# EAGLE design pcb (EAGLE 9.3.1)

## Sheet 1 of 3
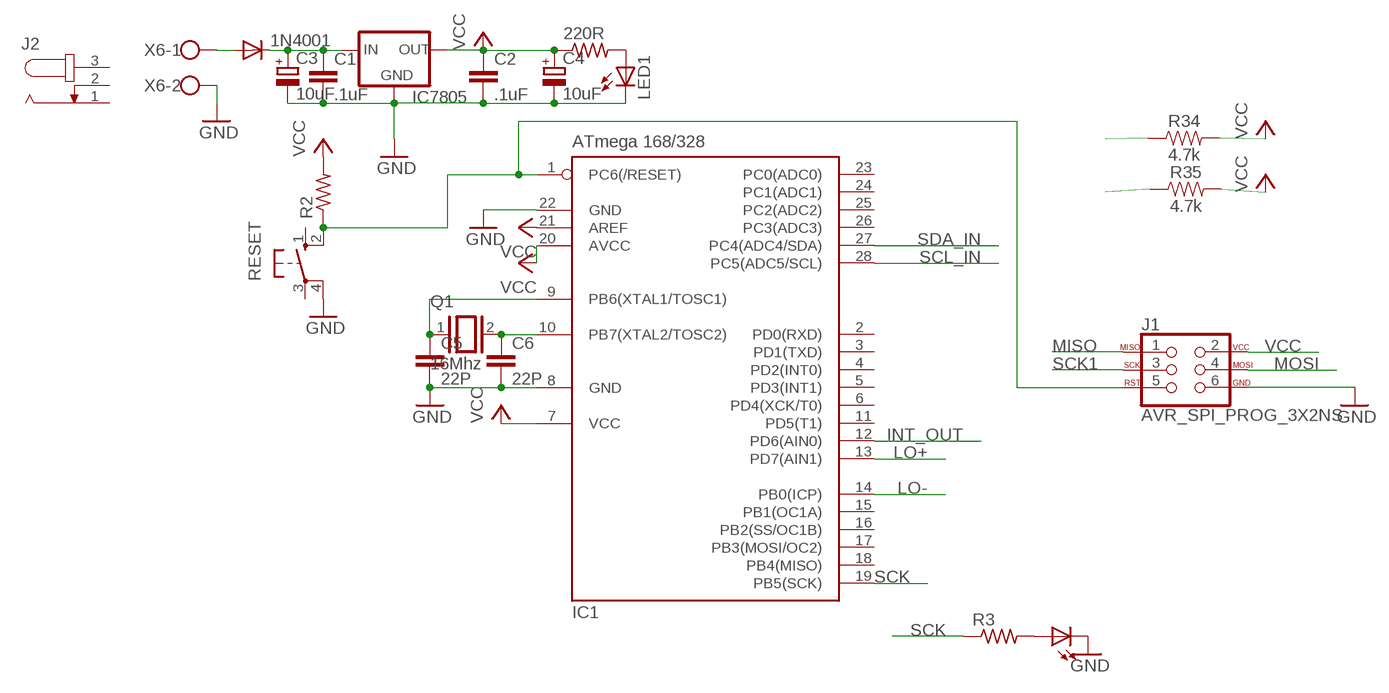
[diagram p0: schematic, sheet 1]

### Parts
1N4001  BYT85  [DO220S]
220R  R-US_0204/7  [0204/7]
C1  .1uF  C-EU025-024X044  [C025-024X044]
C2  .1uF  C-EU025-024X044  [C025-024X044]
C3  10uF  CPOL-EUE1.8-4  [E1,8-4]
C4  10uF  CPOL-EUE1.8-4  [E1,8-4]
C5  22P  C-EU025-024X044  [C025-024X044]
C6  22P  C-EU025-024X044  [C025-024X044]
IC1  ATmega 168/328  MEGA8-P  [DIL28-3]
IC7805  78XXS  [78XXS]
J1  AVR_SPI_PROG_3X2NS  [2X3-NS]
J2  JACK-PLUG0  [SPC4077]
LED1  LED3MM  [LED3MM]
LED2  LED3MM  [LED3MM]
Q1  16Mhz  XTAL/S  [QS]
R2  R-US_0204/7  [0204/7]
R3  R-US_0204/7  [0204/7]
R34  4.7k  4.7KOHM-0603-1/10W-1%  [0603]
R35  4.7k  4.7KOHM-0603-1/10W-1%  [0603]
RESET  10-XX  [B3F-10XX]
X6  W237-102  [W237-102]

### Nets
GND: C1.2 C2.2 C3.- C4.- C5.2 C6.2 IC1.8(GND) IC1.22(GND) IC7805.GND J1.6 LED1.K(C) LED2.K(C) RESET.4(P1) X6.2 ; also sheet 2,3
INT_OUT: IC1.12(PD6(AIN0)) ; also sheet 3
LO+: IC1.13(PD7(AIN1)) ; also sheet 2
LO-: IC1.14(PB0(ICP)) ; also sheet 2
MISO: J1.1
MOSI: J1.4
N$1: 1N4001.C C1.1 C3.+ IC7805.IN
N$2: R34.1
N$3: R35.1
N$21: 1N4001.A X6.1
N$23: 220R.2 LED1.A
N$24: C6.1 IC1.10(PB7(XTAL2/TOSC2)) Q1.2
N$25: C5.1 IC1.9(PB6(XTAL1/TOSC1)) Q1.1
N$26: IC1.1(PC6(/RESET)) J1.5 R2.1 RESET.2(S1)
N$30: LED2.A R3.2
SCK: IC1.19(PB5(SCK)) R3.1
SCK1: J1.3
SCL_IN: IC1.28(PC5(ADC5/SCL)) ; also sheet 3
SDA_IN: IC1.27(PC4(ADC4/SDA)) ; also sheet 3
VCC: 220R.1 C2.1 C4.+ IC1.7(VCC) IC1.20(AVCC) IC1.21(AREF) IC7805.OUT J1.2 R2.2 R34.2 R35.2 ; also sheet 3
Unconnected: IC1.2(PD0(RXD)) IC1.3(PD1(TXD)) IC1.4(PD2(INT0)) IC1.5(PD3(INT1)) IC1.6(PD4(XCK/T0)) IC1.11(PD5(T1)) IC1.15(PB1(OC1A)) IC1.16(PB2(SS/OC1B)) IC1.17(PB3(MOSI/OC2)) IC1.18(PB4(MISO)) IC1.23(PC0(ADC0)) IC1.24(PC1(ADC1)) IC1.25(PC2(ADC2)) IC1.26(PC3(ADC3)) J2.1 J2.2 J2.3 RESET.1(S) RESET.3(P)

## Sheet 2 of 3
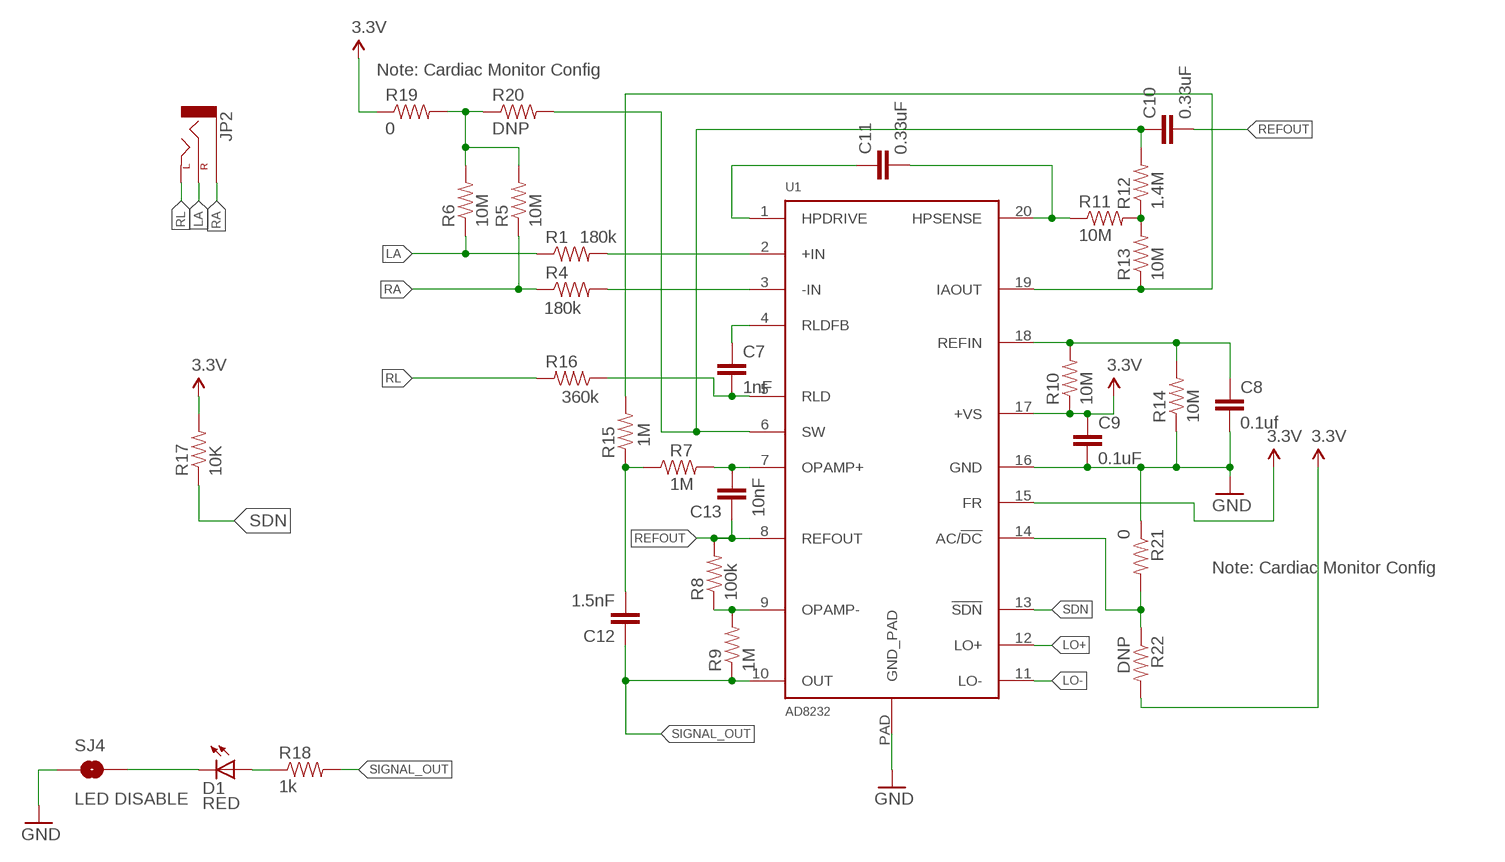
[diagram p1: schematic, sheet 2]

### Parts
C7  1nF  CAP0603-CAP  [0603-CAP]
C8  0.1uf  CAP0603-CAP  [0603-CAP]
C9  0.1uF  CAP0603-CAP  [0603-CAP]
C10  0.33uF  CAP0805  [0805]
C11  0.33uF  CAP0805  [0805]
C12  1.5nF  CAP0603-CAP  [0603-CAP]
C13  10nF  CAP0603-CAP  [0603-CAP]
D1  RED  LED-RED0603  [LED-0603]
JP2  AUDIO-JACKSMD2  [AUDIO-JACK-3.5MM-SMD]
R1  180k  RESISTOR0603-RES  [0603-RES]
R4  180k  RESISTOR0603-RES  [0603-RES]
R5  10M  RESISTOR0603-RES  [0603-RES]
R6  10M  RESISTOR0603-RES  [0603-RES]
R7  1M  RESISTOR0603-RES  [0603-RES]
R8  100k  RESISTOR0603-RES  [0603-RES]
R9  1M  RESISTOR0603-RES  [0603-RES]
R10  10M  RESISTOR0603-RES  [0603-RES]
R11  10M  RESISTOR0603-RES  [0603-RES]
R12  1.4M  RESISTOR0603-RES  [0603-RES]
R13  10M  RESISTOR0603-RES  [0603-RES]
R14  10M  RESISTOR0603-RES  [0603-RES]
R15  1M  RESISTOR0603-RES  [0603-RES]
R16  360k  RESISTOR0603-RES  [0603-RES]
R17  10K  10KOHM1/10W1%(0603)0603  [0603-RES]
R18  1k  1K-1%  [0603-RES]
R19  0  0OHM1/10W5%(0603)  [0603]
R20  DNP  0OHM1/10W5%(0603)  [0603]
R21  0  0OHM1/10W5%(0603)  [0603]
R22  DNP  0OHM1/10W5%(0603)  [0603]
SJ4  LED DISABLE  SOLDERJUMPERTRACE  [SJ_2S-TRACE]
U1  AD8232  [LFCSP_20]

### Nets
3.3V: C9.1 R10.1 R17.2 R19.1 R22.2 U1.15(FR) U1.17(+VS)
GND: C8.2 C9.2 R14.1 R21.1 SJ4.1 U1.16(GND) U1.PAD(GND_PAD) ; also sheet 1,3
LA: JP2.RING(RIGHT) R1.1 R6.1
LO+: U1.12(LO+) ; also sheet 1
LO-: U1.11(LO-) ; also sheet 1
N$22: R1.2 U1.2(+IN)
N$27: R4.2 U1.3(-IN)
N$28: C13.2 R7.2 U1.7(OPAMP+)
N$31: C11.2 R11.1 U1.20(HPSENSE)
N$32: C8.1 R10.2 R14.2 U1.18(REFIN)
N$33: R8.1 R9.2 U1.9(OPAMP-)
N$34: C11.1 U1.1(HPDRIVE)
N$35: R11.2 R12.1 R13.2
N$36: C10.1 R12.2 R20.2 U1.6(SW)
N$37: C7.1 U1.4(RLDFB)
N$38: C12.2 R7.1 R15.1
N$39: C7.2 R16.1 U1.5(RLD)
N$40: R13.1 R15.2 U1.19(IAOUT)
N$41: R5.2 R6.2 R19.2 R20.1
N$42: D1.A R18.1
N$43: D1.C SJ4.2
N$44: R21.2 R22.1 U1.14(AC/!DC)
RA: JP2.SLEEVE R4.1 R5.1
REFOUT: C10.2 C13.1 R8.2 U1.8(REFOUT)
RL: JP2.TIP(LEFT) R16.2
SDN: R17.1 U1.13(!SDN)
SIGNAL_OUT: C12.1 R9.1 R18.2 U1.10(OUT)

### Notes on the sheet
- Note: Cardiac Monitor Config
- Note: Cardiac Monitor Config

## Sheet 3 of 3
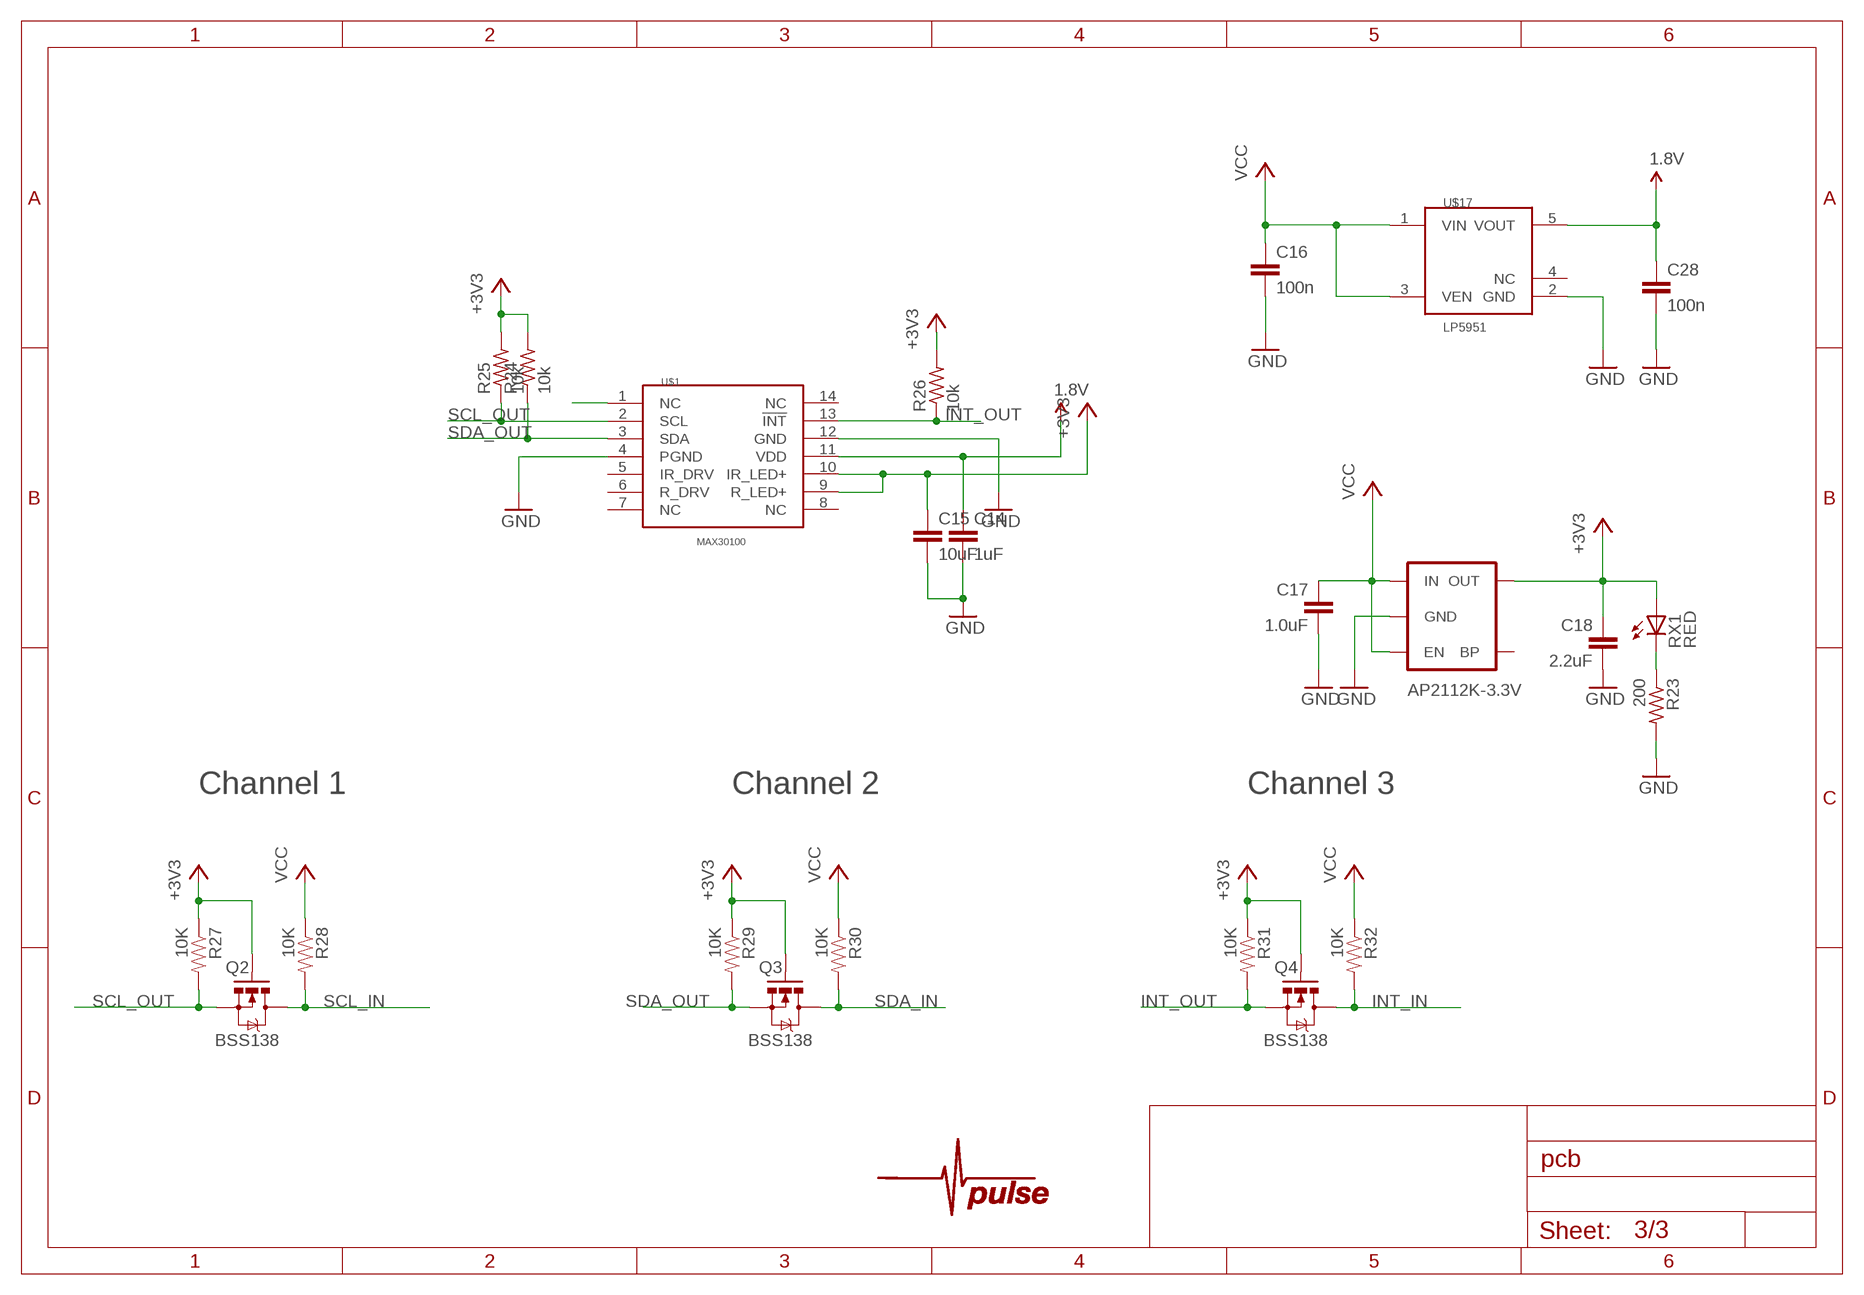
[diagram p2: schematic, sheet 3]

### Parts
C14  1uF  C-EUC0805  [C0805]
C15  10uF  C-EUC0805  [C0805]
C16  100n  C-EUC0402  [C0402]
C17  1.0uF  1.0UF-25V-+80/-20(0805)  [0805]
C18  2.2uF  C-EUC0805  [C0805]
C28  100n  C-EUC0402  [C0402]
Q2  BSS138  MOSFET-NCHANNELSMD  [SOT23-3]
Q3  BSS138  MOSFET-NCHANNELSMD  [SOT23-3]
Q4  BSS138  MOSFET-NCHANNELSMD  [SOT23-3]
R23  200  R-US_R0402  [R0402]
R24  10k  R-US_R0402  [R0402]
R25  10k  R-US_R0402  [R0402]
R26  10k  R-US_R0402  [R0402]
R27  10K  RESISTOR0402-RES  [0402-RES]
R28  10K  RESISTOR0402-RES  [0402-RES]
R29  10K  RESISTOR0402-RES  [0402-RES]
R30  10K  RESISTOR0402-RES  [0402-RES]
R31  10K  RESISTOR0402-RES  [0402-RES]
R32  10K  RESISTOR0402-RES  [0402-RES]
RX1  RED  LEDCHIPLED_0603  [CHIPLED_0603]
U2  AP2112K-3.3V  V_REG_LDOSMD  [SOT23-5]
U$1  MAX30100  [OESIP-14]
U$3  PROTY_LOGO_WITH_TEXT  [PROTY_WITH_TEXT]
U$4  PULSE  [PULSE]
U$17  LP5951  [SC70-5]

### Nets
1.8V: C14.1 C28.1 U$1.11(VDD) U$17.5(VOUT)
+3V3: C15.1 C18.1 Q2.1(G) Q3.1(G) Q4.1(G) R24.2 R25.2 R26.2 R27.1 R29.1 R31.1 RX1.A U2.5(OUT) U$1.9(R_LED+) U$1.10(IR_LED+)
GND: C14.2 C15.2 C16.2 C17.2 C18.2 C28.2 R23.2 U2.2(GND) U$1.4(PGND) U$1.12(GND) U$17.2(GND) ; also sheet 1,2
INT_IN: Q4.3(D) R32.2
INT_OUT: Q4.2(S) R26.1 R31.2 U$1.13(!INT) ; also sheet 1
N$45: R23.1 RX1.C
N$46: C17.1 U2.1(IN) U2.3(EN)
N$47: U$1.1(NC)
SCL_IN: Q2.3(D) R28.2 ; also sheet 1
SCL_OUT: Q2.2(S) R25.1 R27.2 U$1.2(SCL)
SDA_IN: Q3.3(D) R30.2 ; also sheet 1
SDA_OUT: Q3.2(S) R24.1 R29.2 U$1.3(SDA)
VCC: C16.1 R28.1 R30.1 R32.1 U$17.1(VIN) U$17.3(VEN) ; also sheet 1
Unconnected: U2.4(BP) U$1.5(IR_DRV) U$1.6(R_DRV) U$1.7(NC) U$1.8(NC) U$1.14(NC) U$17.4(NC)

### Notes on the sheet
- Channel 1 | Channel 2 | Channel 3

## Library data of the parts
1N4001 = diode:BYT85: DIODE
220R R2 R3 R23-R26 = rcl:R-US_: RESISTOR, American symbol
C1 C2 C5 C6 C14-C16 C18 C28 = rcl:C-EU: CAPACITOR, European symbol
C3 C4 = rcl:CPOL-EU: POLARIZED CAPACITOR, European symbol
C7-C13 = SparkFun-Passives:CAP: Capacitor Standard 0603 ceramic capacitor, and 0.1" leaded capacitor.
C17 = SparkFun-Capacitors:1.0UF-25V-+80/-20(0805): CAP-11625; PROD_ID: CAP-11625
D1 = SparkFun-LED:LED-RED: Assorted Red LEDs LilyPad 1206- DIO-09912 1206- DIO-00809 0603- DIO-00819; PROD_ID: DIO-00819
IC1 = atmel:MEGA8-P: MICROCONTROLLER 8 Kbytes FLASH, 1 kbytes SRAM, 512 bytes EEPROM, USART, 4-channel 10 bit ADC, 2-channel 8 bit ADC Pin compatible with Atmega48, ATMega88, ATMega168 Source: avr.lbr
IC7805 = v-reg:78XXS: VOLTAGE REGULATOR
J1 = SparkFun-Connectors:AVR_SPI_PROG_3X2: AVR ISP 6 Pin This is the reduced ISP connector for AVR programming. Common on Arduino. This footprint will take up less PCB space and can be used with a 10-pin to 6-pin adapter such as SKU: BOB-08508 **Special note about "TEST_POINT" package. The stop mask is on the top side, so if you want your programming test points to be on the bottom of your board, make sure to place this package on the bottom side of the board. This also ensure that the orientation to program from the bottom side will be correct. SparkFun Products: SparkFun ISP Pogo Adapter <https://www.sparkfun.com/products/11591> - NS Tiny AVR Programmer <https://www.sparkfun.com/products/11801> -PTH
J2 = con-jack:JACK-PLUG: DC POWER JACK Power Jack, DC, Right Angle, Through Hole, Rated 5A at 16VDC, PC Terminals Distributor: Farnell (www.Farnell.de) Drawing: 84N1161.pdf / 84N1162.pdf Manufacturer: SPC Technology (www.spctechnology.com) Type: SPC4077 / SPC 4078; OC_FARNELL: unknown; OC_NEWARK: unknown
JP2 = SparkFun-Connectors:AUDIO-JACK: 3.5mm Audio Jack Simple 3.5mm common PCB mount audio jack. SKU: PRT-08032; PROD_ID: CONN-10353
LED1 LED2 RX1 = led:LED: LED OSRAM: - CHIPLED LG R971, LG N971, LY N971, LG Q971, LY Q971, LO R971, LY R971 LH N974, LH R974 LS Q976, LO Q976, LY Q976 LO Q996 - Hyper CHIPLED LW Q18S LB Q993, LB Q99A, LB R99A - SideLED LS A670, LO A670, LY A670, LG A670, LP A670 LB A673, LV A673, LT A673, LW A673 LH A674 LY A675 LS A676, LA A676, LO A676, LY A676, LW A676 LS A679, LY A679, LG A679 - Hyper Micro SIDELED® LS Y876, LA Y876, LO Y876, LY Y876 LT Y87S - SmartLED LW L88C, LW L88S LB L89C, LB L89S, LG L890 LS L89K, LO L89K, LY L89K LS L896, LA L896, LO L896, LY L896 - TOPLED LS T670, LO T670, LY T670, LG T670, LP T670 LSG T670, LSP T670, LSY T670, LOP T670, LYG T670 LG T671, LOG T671, LSG T671 LB T673, LV T673, LT T673, LW T673 LH T674 LS T676, LA T676, LO T676, LY T676, LB T676, LH T676, LSB T676, LW T676 LB T67C, LV T67C, LT T67C, LS T67K, LO T67K, LY T67K, LW E67C LS E67B, LA E67B, LO E67B, LY E67B, LB E67C, LV E67C, LT E67C LW T67C LS T679, LY T679, LG T679 LS T770, LO T770, LY T770, LG T770, LP T770 LB T773, LV T773, LT T773, LW T773 LH T774 LS E675, LA E675, LY E675, LS T675 LS T776, LA T776, LO T776, LY T776, LB T776 LHGB T686 LT T68C, LB T68C - Hyper Mini TOPLED® LB M676 - Mini TOPLED Santana® LG M470 LS M47K, LO M47K, LY M47K Source: http://www.osram.convergy.de LUXEON: - LUMILED® LXK2-PW12-R00, LXK2-PW12-S00, LXK2-PW14-U00, LXK2-PW14-V00 LXK2-PM12-R00, LXK2-PM12-S00, LXK2-PM14-U00 LXK2-PE12-Q00, LXK2-PE12-R00, LXK2-PE12-S00, LXK2-PE14-T00, LXK2-PE14-U00 LXK2-PB12-K00, LXK2-PB12-L00, LXK2-PB12-M00, LXK2-PB14-N00, LXK2-PB14-P00, LXK2-PB14-Q00 LXK2-PR12-L00, LXK2-PR12-M00, LXK2-PR14-Q00, LXK2-PR14-R00 LXK2-PD12-Q00, LXK2-PD12-R00, LXK2-PD12-S00 LXK2-PH12-R00, LXK2-PH12-S00 LXK2-PL12-P00, LXK2-PL12-Q00, LXK2-PL12-R00 Source: www.luxeon.com KINGBRIGHT: KA-3528ASYC Source: www.kingbright.com
Q1 = special:XTAL/S: CRYSTAL
Q2-Q4 = SparkFun:MOSFET-NCHANNEL
R1 R4-R16 = SparkFun-Passives:RESISTOR: Resistor Basic schematic elements and footprints for 0603, 1206, and PTH resistors.
R17 = SparkFun-Resistors:10KOHM1/10W1%(0603): RES-00824; PROD_ID: RES-00824
R18 = SparkFun-Resistors:1K-1%: 1k-ohm SMT 1/10W - 1% (0603) RES-07856; PROD_ID: RES-07856
R19 R21 = SparkFun-Resistors:0OHM1/10W5%(0603): RES-08609; PROD_ID: RES-08609
R20 R22 = SparkFun-Resistors:0OHM1/10W5%(0603): RES-08609; PROD_ID: RES-08609; VALUE: 0
R27-R32 = SparkFun:RESISTOR: Resistor Basic schematic elements and footprints for 0603, 1206, and PTH resistors.
R34 R35 = SparkFun-Resistors:4.7KOHM: 4.7kΩ resistor A resistor is a passive two-terminal electrical component that implements electrical resistance as a circuit element. Resistors act to reduce current flow, and, at the same time, act to lower voltage levels within circuits. - Wikipedia; PROD_ID: RES-07857
RESET = switch-omron:10-XX: OMRON SWITCH
SJ4 = SparkFun-Passives:SOLDERJUMPER: Solder Jumper Standard SMD solder jumper. Used to automate production. Two varients : Normally Open and Normally Closed are the same, but have different paste layers. NC will have a large amount of paste and should jumper during reflow.
U1 = AD8232:AD8232
U2 = SparkFun-PowerIC:V_REG_LDO: Voltage Regulator LDO Standard 150mA LDO voltage regulator in SOT-23 layout. Micrel part MIC5205. BP (by-pass) pin is used to lower output noise with 470pF cap.; PROD_ID: VREG-12457
U$1 = circuitects:MAX30100
U$3 = circuitects:PROTY_LOGO_WITH_TEXT
U$4 = circuitects:PULSE
U$17 = circuitects:LP5951
X6 = con-wago-500:W237-102: WAGO SCREW CLAMP

## Board
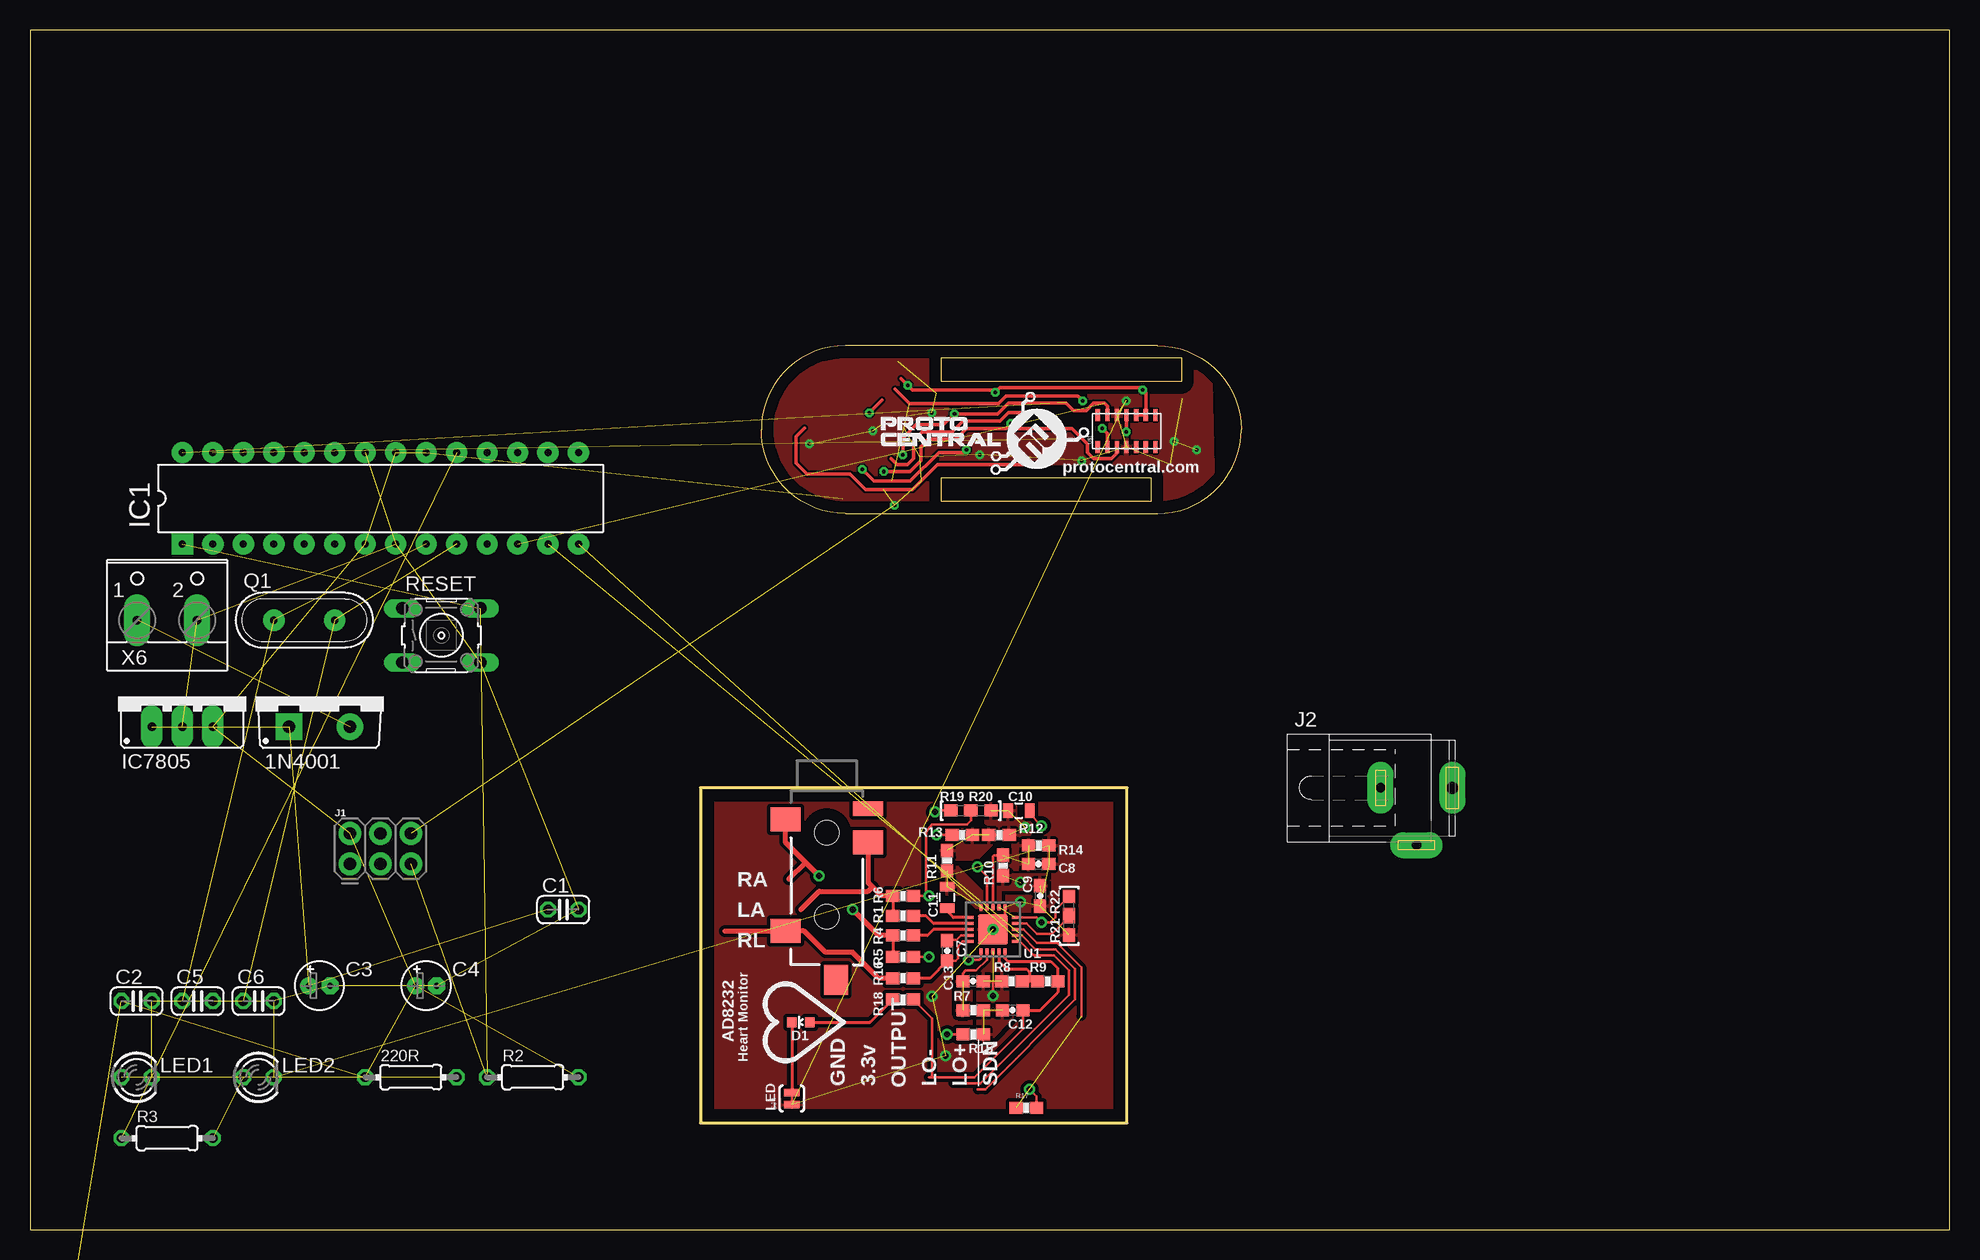
[diagram p3: board, top side]
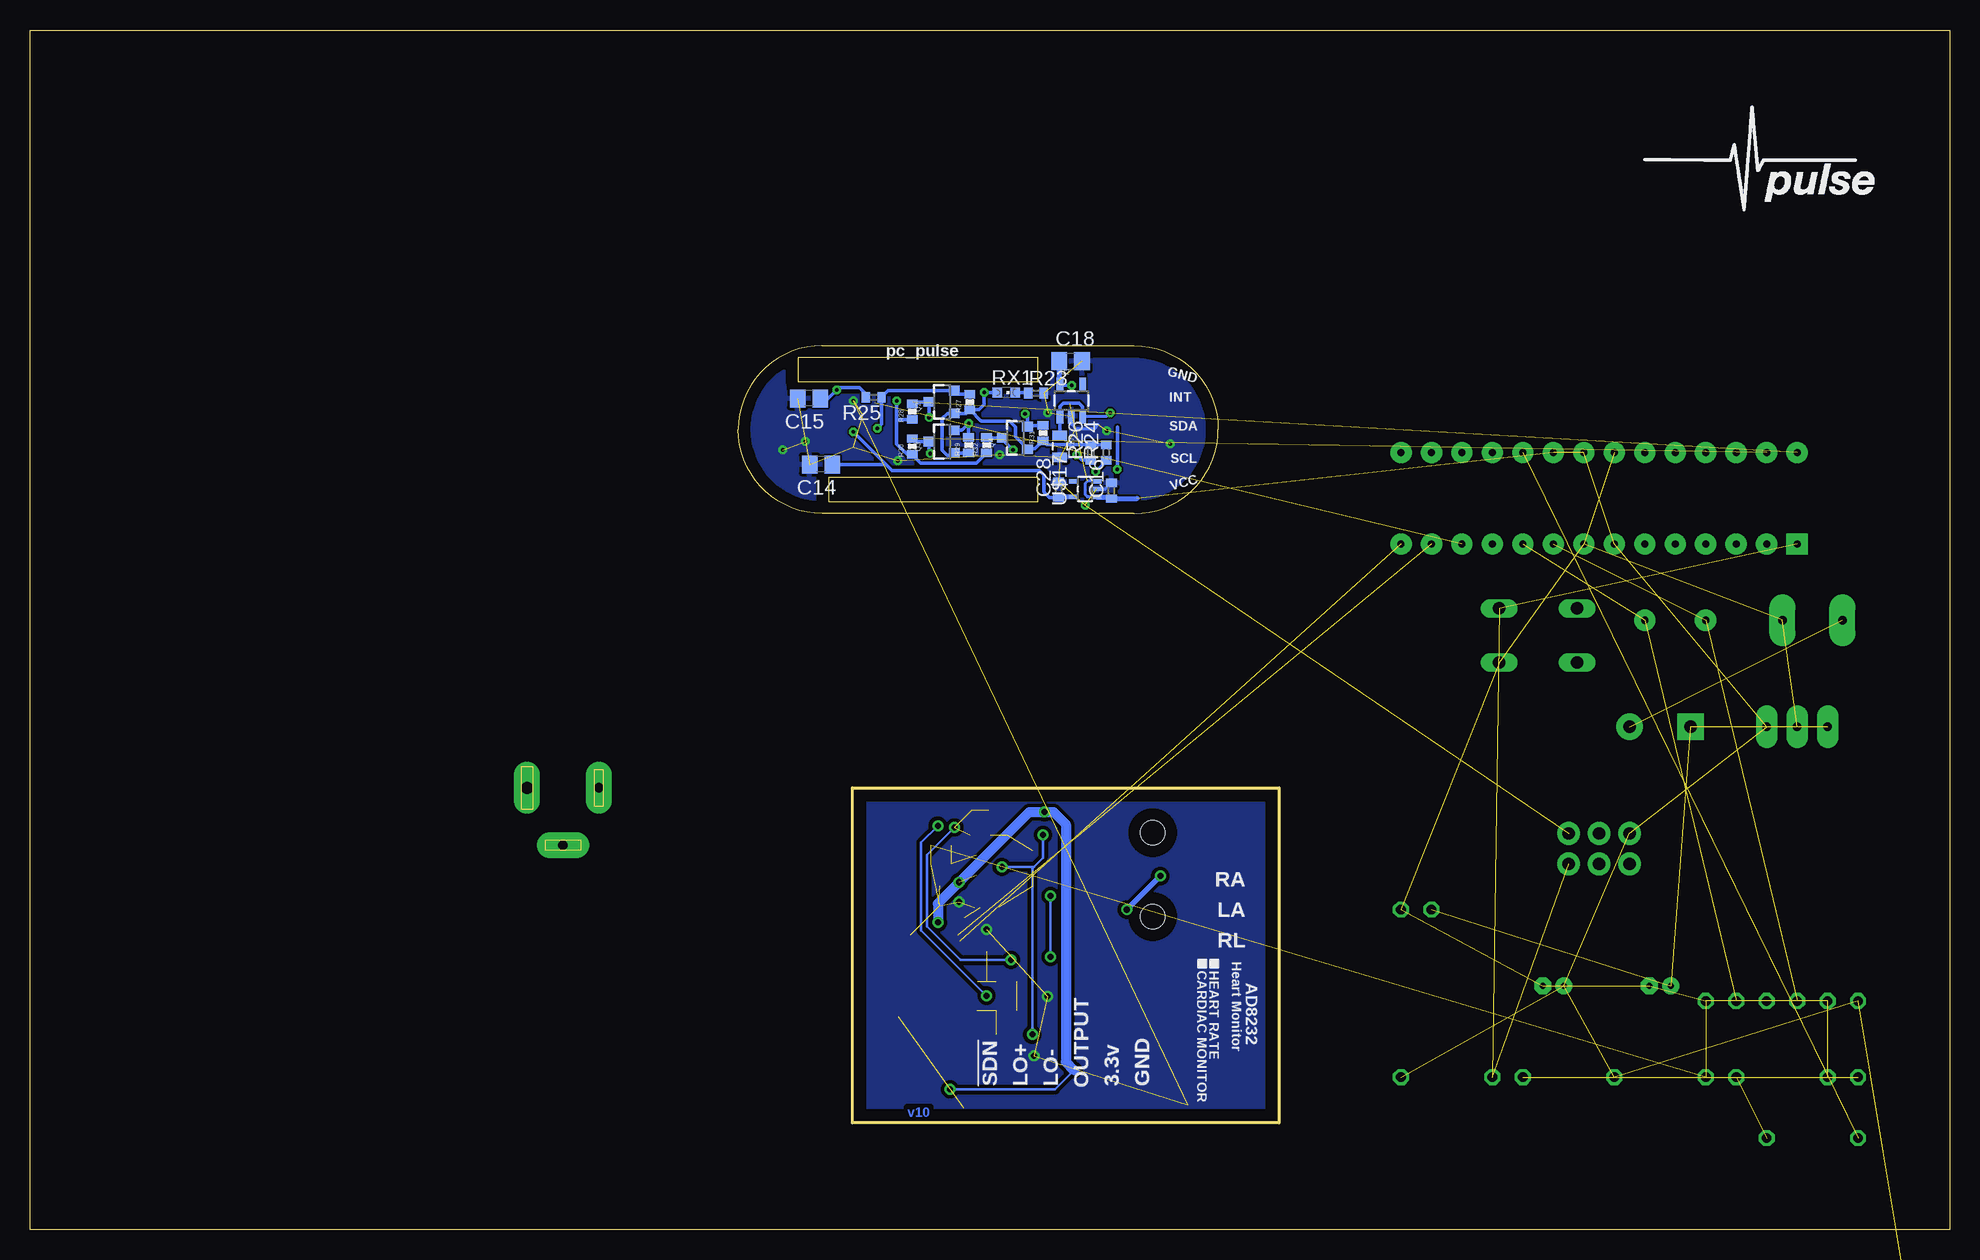
[diagram p4: board, bottom side, seen from below]

Size 160 x 100 mm. Coordinates in mm from the lower left corner, seen from the top.
Outline: 0,0 160,0 160,100 0,100 0,0
Outline: 91.44,8.89 91.44,36.83 55.88,36.83 55.88,8.89 91.44,8.89
Outline: 67.96,59.69 93.96,59.69 arc90 100.96,66.69 arc90 93.96,73.69 67.96,73.69 arc90 60.96,66.69 arc90 67.96,59.69
Outline: 75.96,72.69 95.96,72.69 95.96,70.69 75.96,70.69 75.96,72.69
Outline: 75.96,62.69 93.42,62.69 93.42,60.69 75.96,60.69 75.96,62.69
Copper layers (1*16): Top 0.035mm / dielectric 1.5mm / Bottom 0.035mm
Design rules "default": minimum track width 6mil, minimum drill 0.35mm, track to track 6mil, track to pad 6mil, pad to pad 6mil, via to via 6mil, smd to smd 6mil, copper to edge 40mil, drill to drill 6mil, minimum pad ring 10mil, minimum via ring 8mil, stop-mask expansion 4mil, vias tented up to drill 0mil, thermal gap 10mil

### Footprints (pad centres in the part's own frame; a part is rotated, then mirrored left to right if it is on the bottom)
DO220S = drill 1.016 pad 2.184: A 2.54,-2.54 | drill 1.016 pad 2.184 square: C -2.54,-2.54
0204/7 = drill 0.813 octagon: 1 -3.81,0; 2 3.81,0
C025-024X044 = drill 0.813 octagon: 1 -1.27,0; 2 1.27,0
E1,8-4 = drill 0.5 pad 1.422: + -0.889,0 | drill 0.5 pad 1.422 octagon: - 0.889,0
0603-CAP = smd 1.1 x 1: 1 -0.85,0; 2 0.85,0
0805 = smd 0.8 x 1.2: 1 -0.9,0; 2 0.9,0
C0805 = smd 1.3 x 1.5: 1 -0.95,0; 2 0.95,0
C0402 = smd 0.7 x 0.9: 1 -0.65,0; 2 0.65,0
LED-0603 = smd 0.8 x 0.8: A 0,-0.75; C 0,0.75
DIL28-3 = drill 0.6 pad 1.778 square: 1 -16.51,-3.81 | drill 0.6 pad 1.778: 2 -13.97,-3.81; 3 -11.43,-3.81; 4 -8.89,-3.81; 5 -6.35,-3.81; 6 -3.81,-3.81; 7 -1.27,-3.81; 8 1.27,-3.81; 9 3.81,-3.81; 10 6.35,-3.81; 11 8.89,-3.81; 12 11.43,-3.81; 13 13.97,-3.81; 14 16.51,-3.81; 15 16.51,3.81; 16 13.97,3.81; 17 11.43,3.81; 18 8.89,3.81; 19 6.35,3.81; 20 3.81,3.81; 21 1.27,3.81; 22 -1.27,3.81; 23 -3.81,3.81; 24 -6.35,3.81; 25 -8.89,3.81; 26 -11.43,3.81; 27 -13.97,3.81; 28 -16.51,3.81
78XXS = drill 0.7 pad 1.778 long: GND 0,-2.54; IN -2.54,-2.54; OUT 2.54,-2.54
2X3-NS = drill 1.016 pad 1.88: 1 -2.54,-1.27; 2 -2.54,1.27; 3 0,-1.27; 4 0,1.27; 5 2.54,-1.27; 6 2.54,1.27
SPC4077 = drill 0.8 pad 2.184 long: 1 -3,0; 2 0,-4.8 | drill 1 pad 2.184 long: 3 3,0
AUDIO-JACK-3.5MM-SMD = smd 2 x 2.5: RING 4.3,3.45; SLEEVE 2.4,-3.45; TIP 11.7,-3.45 | smd 1.2 x 2.5: RSH 1.5,3.45 | smd 2.5 x 2: TSH 15.75,0.75 | hole 2: 3.5,0; 10.5,0
LED3MM = drill 0.813 octagon: A -1.27,0; K 1.27,0
QS = drill 0.61 pad 1.778: 1 -2.54,0; 2 2.54,0
SOT23-3 = smd 0.8 x 0.9: 1 -0.95,-1; 2 0.95,-1; 3 0,1.1
0603-RES = smd 1.1 x 1: 1 -0.85,0; 2 0.85,0
0603 = smd 1.1 x 1: 1 -0.85,0; 2 0.85,0
R0402 = smd 0.7 x 0.9: 1 -0.65,0; 2 0.65,0
0402-RES = smd 0.7 x 0.9: 1 -0.65,0; 2 0.65,0
B3F-10XX = drill 1.016 long: 1 -3.251,2.261; 2 3.251,2.261; 3 -3.251,-2.261; 4 3.251,-2.261
CHIPLED_0603 = smd 0.8 x 0.8: A 0,-0.75; C 0,0.75
SJ_2S-TRACE = smd 0.635 x 1.27: 1 -0.508,0; 2 0.508,0
LFCSP_20 = smd 0.5 x 0.25: 1 -1.85,1; 2 -1.85,0.5; 3 -1.85,0; 4 -1.85,-0.5; 5 -1.85,-1; 11 1.85,-1; 12 1.85,-0.5; 13 1.85,0; 14 1.85,0.5; 15 1.85,1 | smd 0.25 x 0.5: 6 -1,-1.85; 7 -0.5,-1.85; 8 0,-1.85; 9 0.5,-1.85; 10 1,-1.85; 16 1,1.85; 17 0.5,1.85; 18 0,1.85; 19 -0.5,1.85; 20 -1,1.85 | smd 2.5 x 2.5: PAD 0,0
SOT23-5 = smd 0.55 x 1.2: 1 -0.95,-1.3; 2 0,-1.3; 3 0.95,-1.3; 4 0.95,1.3; 5 -0.95,1.3
OESIP-14 = smd 1 x 0.35: 1 -1.325,2.4; 2 -1.325,1.6; 3 -1.325,0.8; 4 -1.325,0; 5 -1.325,-0.8; 6 -1.325,-1.6; 7 -1.325,-2.4; 8 1.325,-2.4; 9 1.325,-1.6; 10 1.325,-0.8; 11 1.325,0; 12 1.325,0.8; 13 1.325,1.6; 14 1.325,2.4
SC70-5 = smd 0.35 x 0.8: 1 -0.65,-0.95; 2 0,-0.95; 3 0.65,-0.95; 4 0.65,0.95; 5 -0.65,0.95
W237-102 = drill 0.7 pad 2.184 long: 1 -2.5,-1.27; 2 2.5,-1.27

### Placement (x,y rotation side)
1N4001  24.13,44.45 0 top
220R  31.75,12.7 0 top
C1  44.45,26.67 0 top
C2  8.89,19.05 0 top
C3  24.13,20.32 0 top
C4  33.02,20.32 0 top
C5  13.97,19.05 0 top
C6  19.05,19.05 0 top
C7  76.45,23.24 270 top
C8  84.07,30.48 0 top
C9  84.2,27.81 270 top
C10  82.42,34.92 0 top
C11  76.45,27.69 90 top
C12  81.92,18.29 180 top
C13  78.61,20.7 180 top
C14  94.06,63.79 180 bottom
C15  95.06,69.29 180 bottom
C16  69.86,61.59 90 bottom
C17  74.16,65.29 270 bottom
C18  73.26,72.39 0 bottom
C28  74.26,61.69 90 bottom
D1  64.26,17.27 90 top
IC1  29.21,60.96 0 top
IC7805  12.7,44.45 0 top
J1  29.21,31.75 0 top
J2  115.57,36.83 0 top
JP2  66.42,36.58 270 top
LED1  8.89,12.7 0 top
LED2  19.05,12.7 0 top
Q1  22.86,50.8 0 top
Q2  83.96,68.99 90 bottom
Q3  83.96,65.69 90 bottom
Q4  77.86,65.99 90 bottom
R1  72.77,26.16 0 top
R2  41.91,12.7 0 top
R3  11.43,7.62 0 top
R4  72.77,24.51 0 top
R5  72.77,22.73 0 top
R6  72.77,27.81 0 top
R7  78.61,18.29 180 top
R8  81.85,20.7 180 top
R9  84.84,20.7 180 top
R10  81.09,30.35 90 top
R11  76.45,30.73 90 top
R12  80.77,32.89 0 top
R13  77.72,32.89 0 top
R14  84.07,32 180 top
R15  78.61,16.26 180 top
R16  72.77,20.95 180 top
R17  83.06,10.16 0 top
R18  72.77,19.18 0 top
R19  77.6,34.92 0 top
R20  79.25,34.92 0 top
R21  86.61,25.4 90 top
R22  86.61,26.92 90 top
R23  76.15,69.72 0 bottom
R24  70.29,64.76 90 bottom
R25  89.67,69.38 180 bottom
R26  71.59,64.78 90 bottom
R27  81.66,68.99 90 bottom
R28  86.46,68.19 90 bottom
R29  81.76,65.39 90 bottom
R30  86.46,65.29 90 bottom
R31  75.56,66.39 90 bottom
R32  80.26,65.39 90 bottom
R34  2.54,-6.35 0 top  (outside the outline)
R35  2.54,-10.16 0 top  (outside the outline)
RESET  34.29,49.53 0 top
RX1  78.62,69.77 270 bottom
SJ4  63.5,10.92 90 top
U1  80.26,25.02 0 top
U2  73.2,69.1 0 bottom
U$1  91.4,66.56 90 top
U$3  69.86,62.89 0 top
U$4  25.88,84.38 0 bottom
U$17  72.05,61.73 90 bottom
X6  11.43,52.07 0 top

### Tracks (layer width: path | path; a pad name or v marks a point on that pad's centre or on a via)
1.8V  (via drill 0.3)
  Top 0.305: U$1.11 91.4,66.53 v91.36,66.49
  Bottom 0.254: 74.2,60.98 C28.1
  Bottom 0.305: C28.1 75.01,61.04 75.46,61.49 75.46,62.89 75.86,63.29 88.16,63.29 88.66,63.79 | 88.66,63.79 v91.36,66.49 | C14.1 88.66,63.79
  Bottom 0.406: U$17.5 74.22,61.08 C28.1
3.3V  (via drill 0.51, 0.51 pad 0.3)  (3 unrouted)
  Top 0.203: R17.2 83.91,11.09 v83.31,11.68 | U1.15 83.9,26.02 v84.33,25.59 85.03,25.59 85.47,26.04 85.47,26.63 R22.2 | R19.1 75.56,34.92 v75.44,34.8
  Bottom 0.203: v83.31,11.68 74.55,11.68 72.96,13.27
  Bottom 0.813: v84.33,25.59 84.33,27.18 v82.55,28.96 76.71,34.8 v75.44,34.8 74.68,34.8 73.66,33.78 73.66,13.97 72.96,13.27
  pour Top (isolate 0.203): 80.64,26.67 80.9,26.67 80.9,28.32 84.71,28.32 84.71,29.59 80.64,29.59
+3V3  (via drill 0.3)
  Top 0.305: 72.61,70.94 v73.16,70.39 73.56,69.99 80.26,69.99 v80.46,69.79 80.86,70.19 92.56,70.19 v92.76,69.99 93,69.75 U$1.9 U$1.10
  Bottom 0.254: U2.5 73.07,70.4 v73.16,70.39
  Bottom 0.305: R24.2 70.91,65.43 R26.2 75.25,65.43 R31.1 76.21,65.09 76.86,65.09 | Q4.1 76.86,65.09 | 76.86,65.09 77.86,66.09 77.86,66.89 78.36,67.39 80.71,67.39 R27.1 | R27.1 80.91,68.34 80.46,68.79 v80.46,69.79 80.44,69.77 RX1.A | R27.1 81.96,68.04 Q2.1 83.51,68.04 83.96,67.59 83.96,64.99 83.51,64.54 Q3.1 R29.1 | R25.2 90.32,69.65 90.86,70.19 92.56,70.19 v92.76,69.99 93.46,69.29 C15.1
  Bottom 0.406: C18.1 74.21,70.46 U2.5
GND  (via drill 0.3, 0.51)  (41 unrouted)
  Top 0.203: 80.76,25.52 U1.PAD 81.26,26.02 U1.16
  Bottom 0.254: U2.2 73.2,67.13 72.86,66.79 71.26,66.79 70.96,67.09 | U$17.2 70.37,61.73 C16.2
  other vias: 82.55,27.3 80.26,25.02 76.33,14.48 75.18,19.43 70.26,66.59 97.26,64.99 64.96,65.49 72.06,60.39 95.36,65.69 75.16,68.09 87.66,64.09 91.36,69.09 79.16,64.59
  pour Top (isolate 0.305, rank 6): 55.88,36.83 91.44,36.83 91.44,8.89 55.88,8.89
  pour Bottom (isolate 0.305, rank 6): 55.88,36.83 91.44,36.83 91.44,8.89 55.88,8.89
  pour Top: 60.89,72.53 98.32,72.62 98.59,59.68 61.16,59.59
  pour Bottom: 60.86,73.69 100.86,73.89 101.16,59.79 61.16,59.59
INT_IN  (via drill 0.3)
  Top 0.305: v69.36,63.39 70.36,62.39 73.36,62.39 75.76,64.79 77.86,64.79 v78.06,64.99
  Bottom 0.305: R32.2 80.21,65.99 Q4.3 78.96,65.89 v78.06,64.99 | v69.36,63.39 69.36,66.91
INT_OUT  (via drill 0.3)  (1 unrouted)
  Top 0.305: U$1.13 89.8,68.65 89.56,68.89 88.66,68.89 88.06,68.29 86.96,68.29 86.36,68.89 81.56,68.89 80.66,67.99 v77.06,67.99 76.16,67.09 73.86,67.09 72.76,65.99 v72.76,64.59
  Bottom 0.305: v77.06,67.99 76.86,67.79 Q4.2 76.76,67.04 R31.2 | R26.1 72.3,64.13 v72.76,64.59
LA
  Top 0.254: R6.1 R1.1
  Top 0.406: R6.1 70.99,27.81 70.23,28.57 | 70.23,28.57 69.87,28.93 JP2.RING | 64.26,26.67 65.79,28.19 69.85,28.19 70.23,28.57
LO+  (1 unrouted)
  Top 0.203: U1.12 82.67,24.52 83.82,23.37 85.47,23.37 87.12,21.72 87.12,19.18 79.63,11.68 78.99,11.68
LO-  (1 unrouted)
  Top 0.203: U1.11 82.53,24.02 83.69,22.86 85.34,22.86 86.61,21.59 86.61,19.56 79.25,12.19 76.96,12.19
N$1  (3 unrouted)
N$21  (1 unrouted)
N$22
  Top 0.254: U1.2 75.32,25.52 74.68,26.16 R1.2
N$23  (1 unrouted)
N$24  (2 unrouted)
N$25  (2 unrouted)
N$26  (3 unrouted)
N$27
  Top 0.254: U1.3 75.31,25.02 74.8,24.51 R4.2
N$28  (1 unrouted)
  Top 0.203: U1.7 79.76,22.49 78.87,21.59 77.98,21.59 77.76,21.38 C13.2
  pour Top (isolate 0.203): 77.22,21.21 78.49,21.21 78.49,17.78 77.22,17.78
N$30  (1 unrouted)
N$31  (2 unrouted)
  pour Top (isolate 0.203): 79.38,26.54 79.38,28.19 77.34,30.23 75.95,30.23 75.95,27.94 77.6,27.94 79.12,26.54
N$32  (2 unrouted)
  Top 0.203: U1.18 80.26,31.11 80.35,31.2 R10.2
  pour Top (isolate 0.203, rank 2): 81.92,32.51 83.69,32.51 83.69,29.97 82.04,29.97 81.66,30.35 80.64,30.35 80.64,31.75 81.92,31.75
N$33
  Top 0.254: U1.9 80.76,22.36 81.41,21.72 83.06,21.72 83.31,21.46 83.31,20.7 | R8.1 83.31,20.7 | R9.2 83.31,20.7
N$34
  Top 0.254: U1.1 76.98,26.02 76.45,26.54 C11.1
N$35  (2 unrouted)
  pour Top (isolate 0.203, rank 2): 77.72,33.4 80.52,33.4 80.52,32.38 78.99,30.86 75.95,30.86 75.95,32.26 77.72,32.26
N$36  (via drill 0.51)  (3 unrouted)
  Top 0.203: 81.66,32.89 R12.2 | U1.6 79.26,22.62 79.12,22.48 v78.23,22.48
  Bottom 0.203: v82.93,33.53 85.22,31.24 85.22,25.27 82.42,22.48 v78.23,22.48
  pour Top (isolate 0.254): 81.15,32.64 83.19,32.64 83.57,33.27 83.57,33.78 83.19,34.16 82.3,34.16 82.17,34.29 82.17,35.31 80.52,35.31 80.26,35.56 79.63,35.56 79.63,33.91
N$37
  Top 0.203: U1.4 77.61,24.52 77.22,24.13 76.45,24.13 C7.1
N$38  (2 unrouted)
  pour Top (isolate 0.203): 78.99,18.67 81.92,18.67 81.92,17.65 80.01,15.75 78.99,15.75
N$39
  Top 0.203: C7.2 77.13,22.39 77.34,22.61 77.34,23.62 77.74,24.02 U1.5 | R16.1 73.66,20.95
  Top 0.254: C7.2 75.02,20.95 73.66,20.95
N$40  (via drill 0.51)
  Top 0.203: U1.19 79.76,29.46 v78.99,30.23 | R13.1 v75.56,32.89 | R15.2 v76.45,16.26
  Bottom 0.203: 78.11,30.23 v78.99,30.23 76.45,30.23 | 76.45,30.23 76.33,30.23 75.56,30.99 v75.56,32.89 | v76.45,16.26 76.45,30.23
N$41  (via drill 0.51)
  Top 0.203: R5.2 v74.93,22.73 | R6.2 v74.93,27.81 74.68,28.07 74.68,33.15 75.18,33.78 78.11,33.78 78.45,34.12 R19.2 R20.1
  Bottom 0.203: v74.93,22.73 v74.93,27.81
N$42
  Top 0.254: D1.A 70.02,17.27 R18.1
N$43
  Top 0.254: D1.C SJ4.2
N$44
  Top 0.203: U1.14 83.07,25.52 83.95,24.64 85.18,24.64 R22.1 R21.2
N$45
  Bottom 0.305: RX1.C 76.95,69.77 R23.1
N$46  (via drill 0.3)
  Top 0.305: 71.03,69.16 v69.96,68.09
  Bottom 0.254: U2.3 70.25,67.8 v69.96,68.09
  Bottom 0.305: C17.1 U2.1 74.15,68.6 73.86,68.89 72.56,68.89 72.26,68.59 U2.3
RA  (via drill 0.51)
  Top 0.254: R4.1 R5.1
  Top 0.406: R4.1 70.74,24.51 v68.58,26.67 | v65.79,29.46 64.64,30.61 | 64.64,30.61 62.97,32.28 JP2.SLEEVE | 63.25,29.21 64.64,30.61
  Bottom 0.406: v68.58,26.67 v65.79,29.46
REFOUT  (via drill 0.51)  (3 unrouted)
  Top 0.203: C10.2 83.31,34.67 v84.33,33.66 | v80.26,19.49 80.26,20.7
  Top 0.254: R8.2 81.03,20.83
  Bottom 0.203: v84.33,33.66 85.72,32.26 85.72,24.96 v80.26,19.49
  pour Top (isolate 0.203, rank 2): 80.01,23.37 80.52,23.37 80.52,21.97 81.03,21.46 81.53,21.46 81.53,18.92 78.99,18.92 78.99,21.34 80.01,22.35
RL
  Top 0.406: R16.2 70.74,20.95 68.58,23.11 66.29,23.11 64.52,24.89 62.99,24.89 JP2.TIP 57.9,24.88
SCK  (1 unrouted)
SCL_IN  (via drill 0.3)  (1 unrouted)
  Top 0.305: v85.06,67.69 84.66,68.09 81.56,68.09 80.86,67.39 77.76,67.39 76.86,66.49 74.36,66.49 73.66,65.79 73.66,64.29 73.16,63.79 72.26,63.79 71.78,64.27
  Bottom 0.305: R28.2 86.41,68.99 Q2.3 v85.06,67.69
SCL_OUT  (via drill 0.3)
  Top 0.305: U$1.2 89.8,66.35 v89.36,66.79
  Bottom 0.305: R27.2 82.66,69.64 Q2.2 88.46,69.94 R25.1 89.02,67.13 v89.36,66.79
SDA_IN  (via drill 0.3)  (1 unrouted)
  Top 0.305: v84.96,64.69 84.06,63.79 75.66,63.79 73.56,61.69 69.66,61.69 68.36,62.99 64.76,62.99 63.86,63.89 63.86,66.09 64.58,66.81
  Bottom 0.305: R30.2 86.21,65.69 Q3.3 85.06,64.79 v84.96,64.69
SDA_OUT  (via drill 0.3)
  Top 0.305: U$1.3 90.6,64.73 90.16,64.29 88.66,64.29 88.16,64.79 88.16,65.49 86.86,66.79 82.16,66.79 v81.76,67.19 81.36,66.79 78.06,66.79 77.16,65.89 74.86,65.89 74.26,65.29 74.26,64.09 73.36,63.19 v71.16,63.19
  Bottom 0.305: R29.2 v81.76,67.19 82.31,66.64 Q3.2 | R24.1 70.29,64.06 v71.16,63.19
SDN  (1 unrouted)
  Top 0.203: U1.13 82.8,25.02 83.95,23.88 85.6,23.88 87.63,21.84 87.63,17.78
SIGNAL_OUT
  Top 0.203: C12.1 82.77,16.73 78.74,12.7 75.18,12.7 | 75.18,12.7 74.93,12.7 | R18.2 75.18,17.61 75.18,12.7
  Top 0.254: U1.10 81.26,22.62 81.53,22.35 85.09,22.35 85.69,21.76 R9.1 85.69,19.77 84.2,18.29 C12.1
VCC  (via drill 0.3)  (12 unrouted)
  Top 0.305: v87.76,69.09 87.36,69.49 81.36,69.49 80.72,68.85 73.3,68.85 72.1,70.05
  Bottom 0.254: U$17.3 71.87,62.38 72.06,62.19 72.06,61.29 71.86,61.09 U$17.1
  Bottom 0.305: R32.1 81.11,63.89 85.76,63.89 86.46,64.59 R30.1 86.91,64.64 87.76,65.49 87.76,67.59 | 87.76,67.59 v87.76,69.09 | R28.1 87.71,67.54 87.76,67.59
  Bottom 0.406: 67.71,60.94 C16.1 70,61.08 U$17.1

### Text on the board
Bottom: v10
tPlace: protocentral.com | RA | LA | RL | AD8232 | Heart Monitor | GND | 3.3v | OUTPUT | LO- | LO+ | !SDN | LED
bPlace: pc_pulse | GND | INT | SDA | SCL | VCC | RA | LA | RL | Heart Monitor | HEART RATE | CARDIAC MONITOR | AD8232 | GND | 3.3v | OUTPUT | LO- | LO+ | !SDN